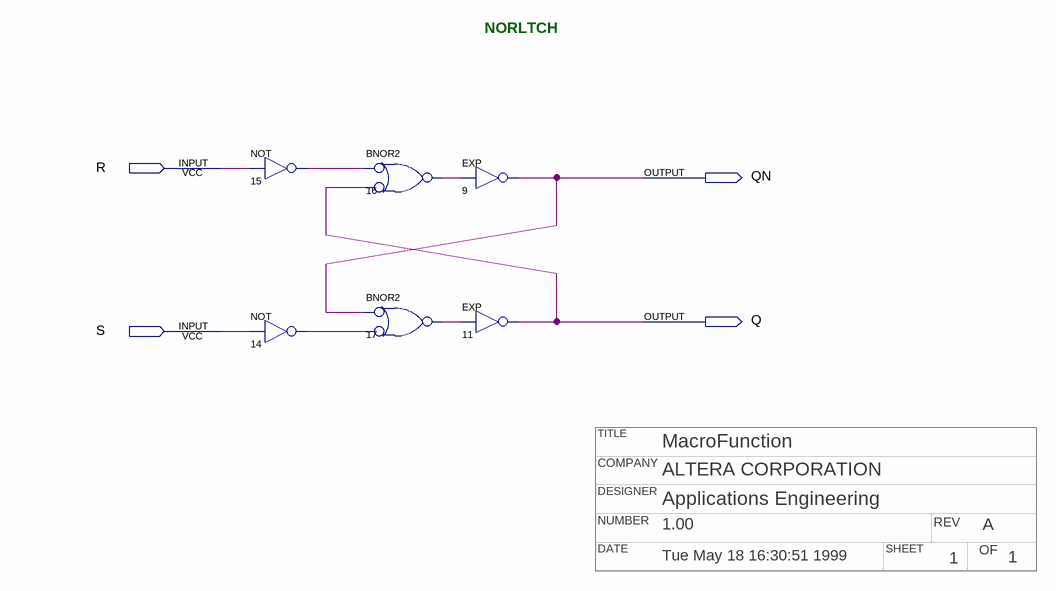
[diagram p0: schematic sheet]
// Quartus schematic norltch.bdf as structural Verilog: 6 symbols, 4 pins
// Title block: TITLE: MacroFunction; COMPANY: ALTERA CORPORATION; DESIGNER: Applications Engineering; NUMBER: 1.00; REV: A; DATE: Tue May 18 16:30:51 1999; SHEET: 1; OF: 1
module norltch (
  input  R,
  input  S,
  output QN,
  output Q
);

  wire n14_out, n15_out, n16_out, n17_out;

  not u_15 (n15_out, R);
  not u_14 (n14_out, S);
  nor u_16 (n16_out, ~n15_out, ~Q);  // BNOR2
  nor u_17 (n17_out, ~QN, ~n14_out);  // BNOR2
  EXP u_9 (.IN(n16_out), .OUT(QN));
  EXP u_11 (.IN(n17_out), .OUT(Q));

  // Notes on the sheet:
  //   NORLTCH
endmodule
